# EAGLE design Mext (EAGLE 6.6.0)
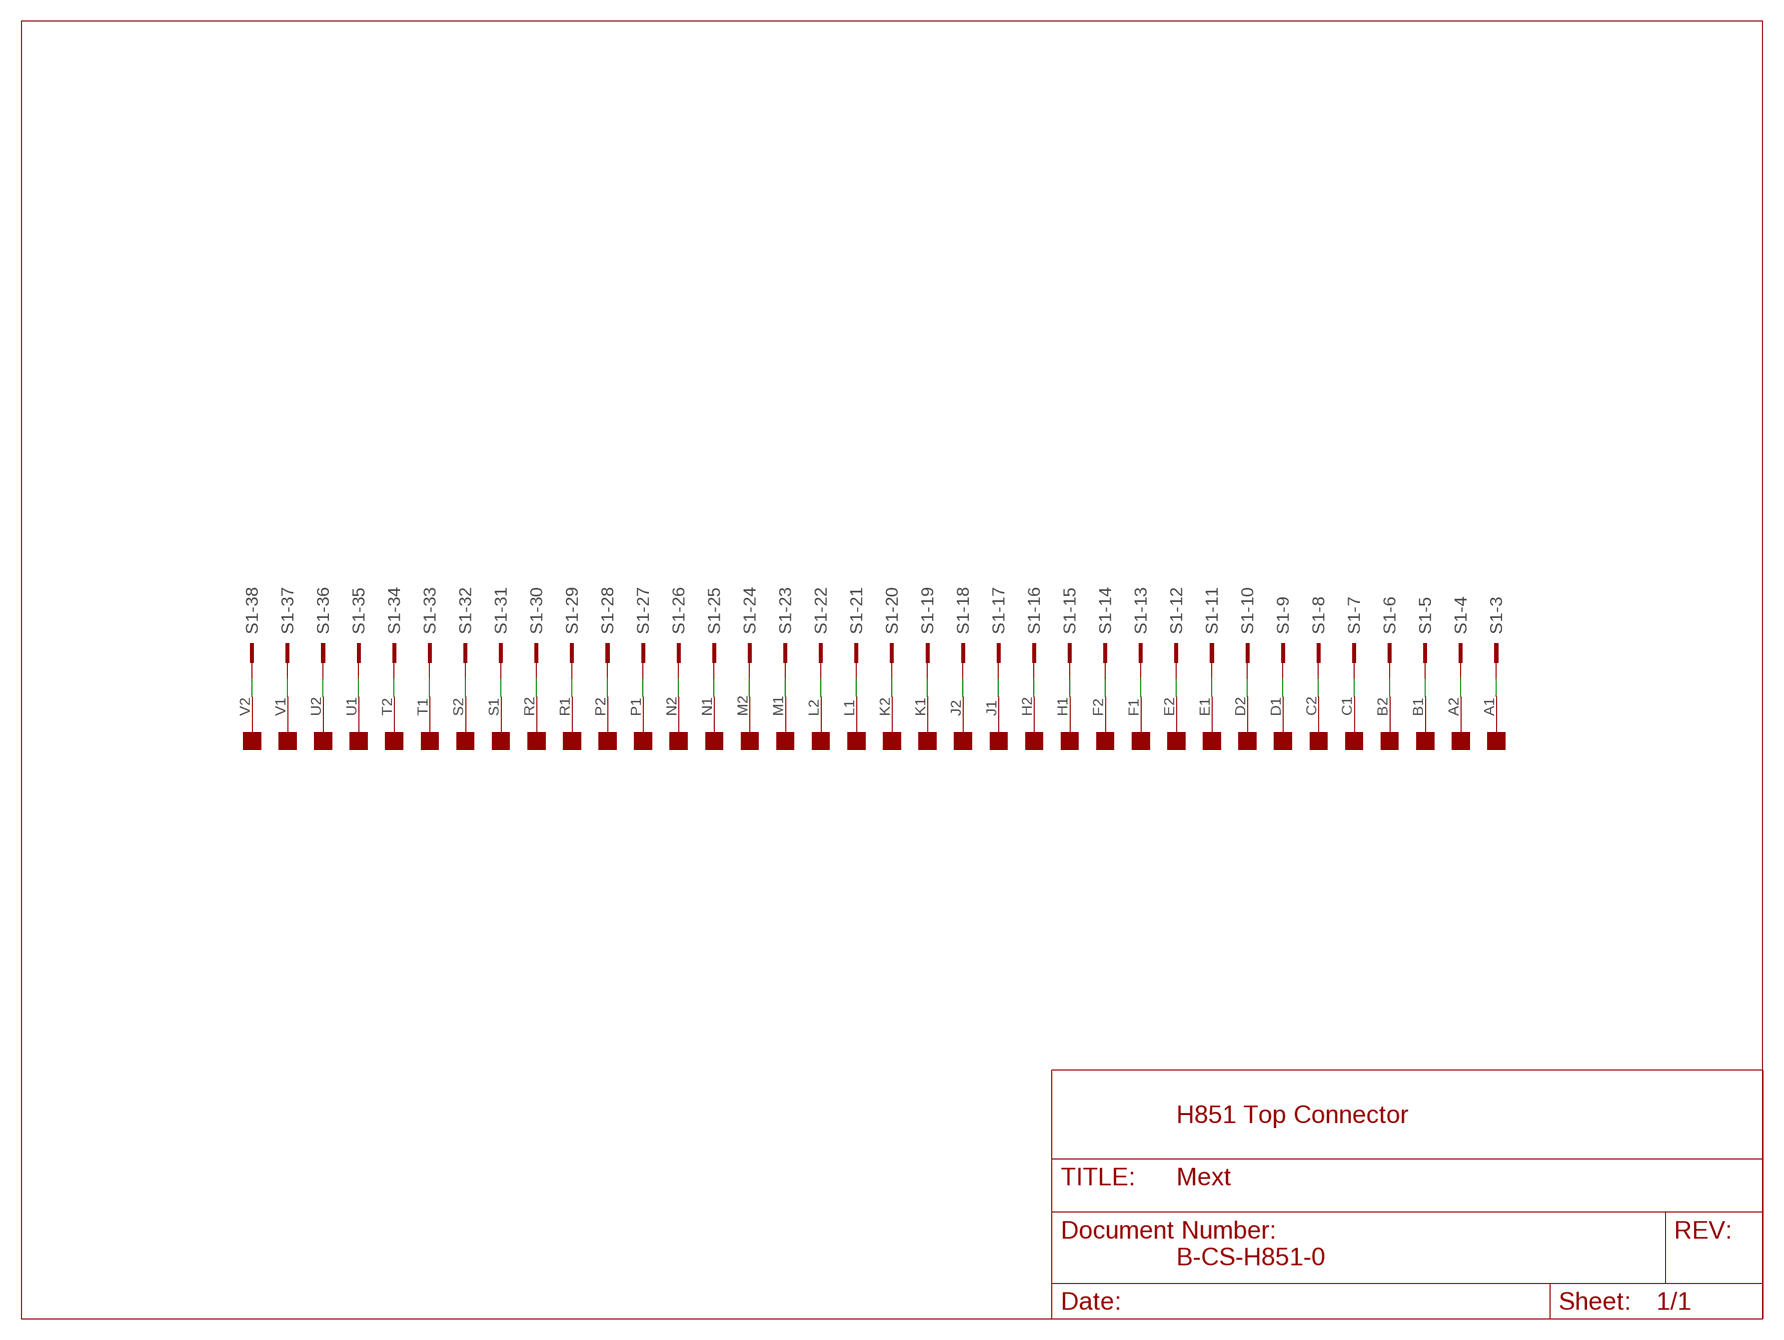
[diagram p0: schematic, sheet 1]

## Parts
S1  40  2540-  [PAK100/2500-40]
U$1  SINGLE  [EDGE-CON2]

## Nets
N$1: S1.37 U$1.V1
N$2: S1.38 U$1.V2
N$3: S1.35 U$1.U1
N$4: S1.36 U$1.U2
N$5: S1.33 U$1.T1
N$6: S1.34 U$1.T2
N$7: S1.31 U$1.S1
N$8: S1.32 U$1.S2
N$9: S1.29 U$1.R1
N$10: S1.30 U$1.R2
N$11: S1.27 U$1.P1
N$12: S1.28 U$1.P2
N$13: S1.25 U$1.N1
N$14: S1.26 U$1.N2
N$15: S1.23 U$1.M1
N$16: S1.24 U$1.M2
N$17: S1.21 U$1.L1
N$18: S1.22 U$1.L2
N$19: S1.19 U$1.K1
N$20: S1.20 U$1.K2
N$21: S1.17 U$1.J1
N$22: S1.18 U$1.J2
N$23: S1.15 U$1.H1
N$24: S1.16 U$1.H2
N$25: S1.13 U$1.F1
N$26: S1.14 U$1.F2
N$27: S1.11 U$1.E1
N$28: S1.12 U$1.E2
N$29: S1.9 U$1.D1
N$30: S1.10 U$1.D2
N$31: S1.7 U$1.C1
N$32: S1.8 U$1.C2
N$33: S1.5 U$1.B1
N$34: S1.6 U$1.B2
N$35: S1.4 U$1.A2
N$36: S1.3 U$1.A1
Unconnected: S1.1 S1.2 S1.39 S1.40

## Notes on the sheet
- H851 Top Connector
- B-CS-H851-0

## Library data of the parts
S1 = con-3m:2540-: 3M (TM) Pak 100 4-Wall Header Source: 3M; OC_FARNELL: unknown; OC_NEWARK: unknown
U$1 = dec-con:SINGLE: Single-Height DEC board

## Board
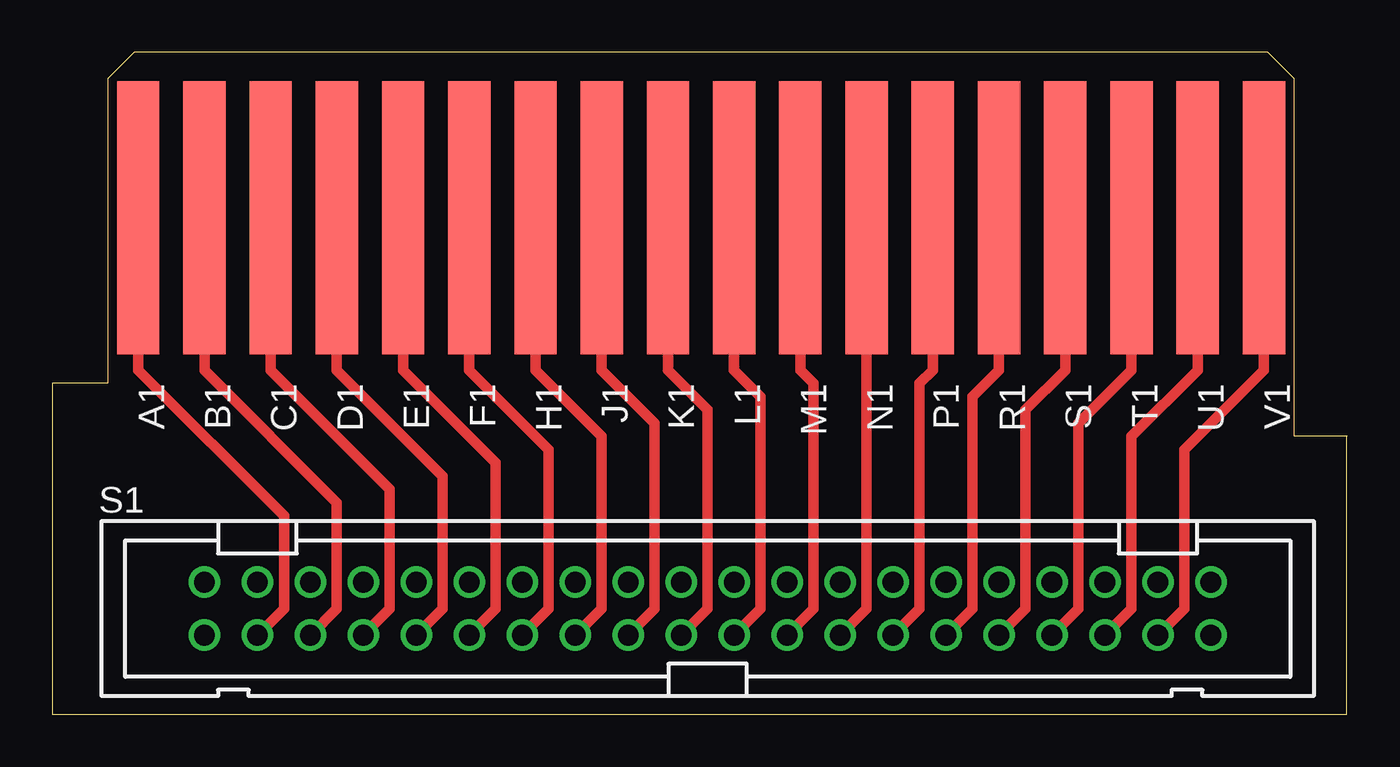
[diagram p1: board, top side]
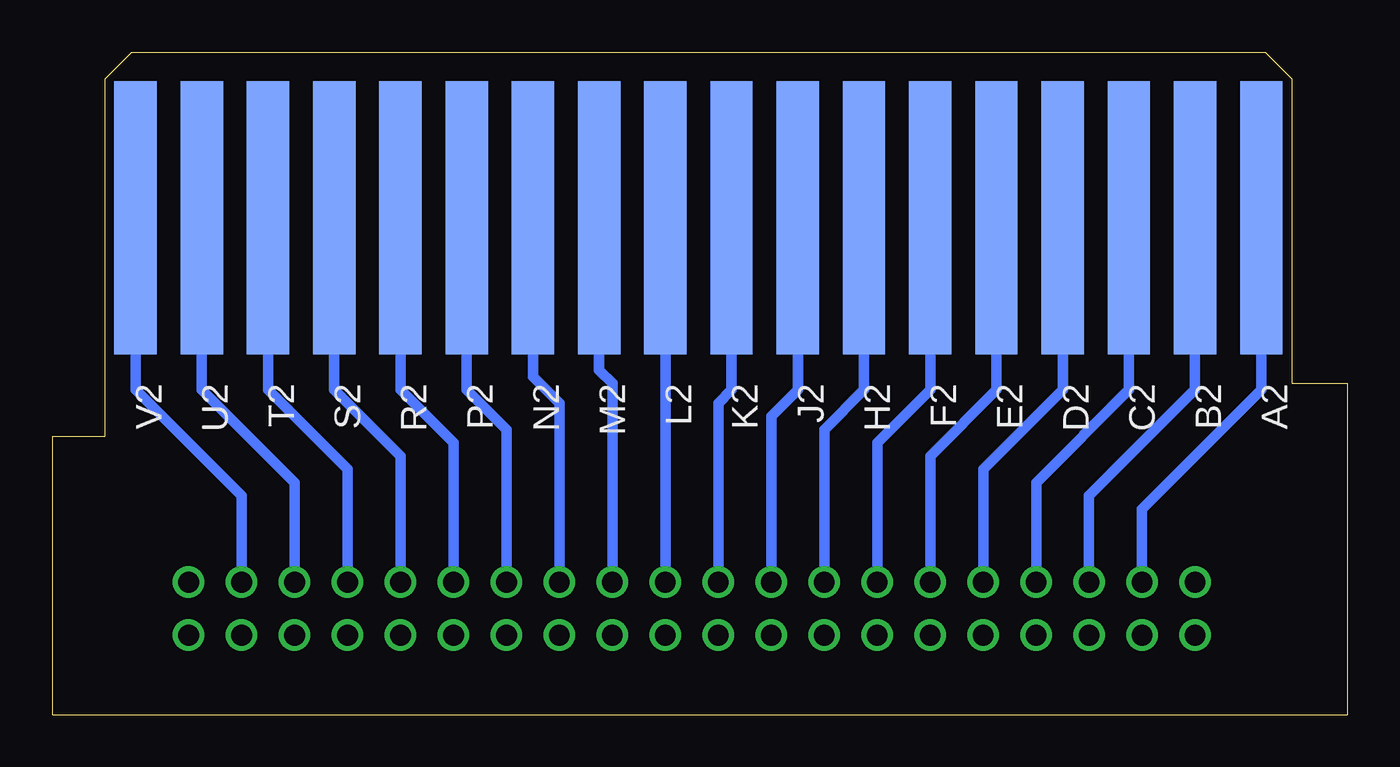
[diagram p2: board, bottom side, seen from below]

Size 62.1 x 31.75 mm. Coordinates in mm from the lower left corner, seen from the top.
Outline: 62.07,13.34 62.07,0 0,0 0,15.88
Copper layers (1+16): Top 0.035mm / dielectric 1.5mm / Bottom 0.035mm
Design rules "16mils *": minimum track width 16mil, minimum drill 32mil, track to track 15mil, track to pad 10mil, pad to pad 10mil, via to via 10mil, smd to smd 10mil, copper to edge 13mil, drill to drill 10mil, minimum pad ring 10mil, minimum via ring 8mil, stop-mask expansion 0mil, vias tented up to drill 0mil, thermal gap 10mil

### Footprints (pad centres in the part's own frame; a part is rotated, then mirrored left to right if it is on the bottom)
PAK100/2500-40 = drill 1 pad 1.422: 1 -24.13,-1.27; 2 -24.13,1.27; 3 -21.59,-1.27; 4 -21.59,1.27; 5 -19.05,-1.27; 6 -19.05,1.27; 7 -16.51,-1.27; 8 -16.51,1.27; 9 -13.97,-1.27; 10 -13.97,1.27; 11 -11.43,-1.27; 12 -11.43,1.27; 13 -8.89,-1.27; 14 -8.89,1.27; 15 -6.35,-1.27; 16 -6.35,1.27; 17 -3.81,-1.27; 18 -3.81,1.27; 19 -1.27,-1.27; 20 -1.27,1.27; 21 1.27,-1.27; 22 1.27,1.27; 23 3.81,-1.27; 24 3.81,1.27; 25 6.35,-1.27; 26 6.35,1.27; 27 8.89,-1.27; 28 8.89,1.27; 29 11.43,-1.27; 30 11.43,1.27; 31 13.97,-1.27; 32 13.97,1.27; 33 16.51,-1.27; 34 16.51,1.27; 35 19.05,-1.27; 36 19.05,1.27; 37 21.59,-1.27; 38 21.59,1.27; 39 24.13,-1.27; 40 24.13,1.27
EDGE-CON2 = smd 13.106 x 2.032: A1 7.938,4.128; B1 7.938,7.303; C1 7.938,10.477; D1 7.938,13.652; E1 7.938,16.828; F1 7.938,20.003; H1 7.938,23.177; J1 7.938,26.352; K1 7.938,29.527; L1 7.938,32.703; M1 7.938,35.877; N1 7.938,39.053; P1 7.938,42.227; R1 7.938,45.403; S1 7.938,48.578; T1 7.938,51.752; U1 7.938,54.928; V1 7.938,58.102 | smd 13.106 x 2.032 bottom: A2 7.938,4.128; B2 7.938,7.303; C2 7.938,10.477; D2 7.938,13.652; E2 7.938,16.828; F2 7.938,20.003; H2 7.938,23.177; J2 7.938,26.352; K2 7.938,29.527; L2 7.938,32.703; M2 7.938,35.877; N2 7.938,39.053; P2 7.938,42.227; R2 7.938,45.403; S2 7.938,48.578; T2 7.938,51.752; U2 7.938,54.928; V2 7.938,58.102

### Placement (x,y rotation side)
S1  31.43,5.08 0 top
U$1  0,31.75 270 top

### Tracks (layer width: path | path; a pad name or v marks a point on that pad's centre or on a via)
N$1
  Top 0.508: S1.37 54.29,5.08 54.29,12.7 58.1,16.51 U$1.V1
N$2
  Bottom 0.508: S1.38 53.02,10.48 58.1,15.56 U$1.V2
N$3
  Top 0.508: S1.35 51.75,5.08 51.75,13.34 54.93,16.51 U$1.U1
N$4
  Bottom 0.508: S1.36 50.48,11.11 54.93,15.56 U$1.U2
N$5
  Top 0.508: S1.33 49.21,5.08 49.21,13.97 51.75,16.51 U$1.T1
N$6
  Bottom 0.508: S1.34 47.94,11.75 51.75,15.56 U$1.T2
N$7
  Top 0.508: S1.31 46.67,5.08 46.67,14.61 48.58,16.51 U$1.S1
N$8
  Bottom 0.508: S1.32 45.4,12.38 48.58,15.56 U$1.S2
N$9
  Top 0.508: S1.29 44.13,5.08 44.13,15.24 45.4,16.51 U$1.R1
N$10
  Bottom 0.508: S1.30 42.86,13.02 45.4,15.56 U$1.R2
N$11
  Top 0.508: S1.27 41.59,5.08 41.59,15.88 42.23,16.51 U$1.P1
N$12
  Bottom 0.508: S1.28 40.32,13.65 42.23,15.56 U$1.P2
N$13
  Top 0.508: S1.25 39.05,5.08 U$1.N1
N$14
  Bottom 0.508: S1.26 37.78,14.92 39.05,16.19 U$1.N2
N$15
  Top 0.508: S1.23 36.51,5.08 36.51,15.88 35.88,16.51 U$1.M1
N$16
  Bottom 0.508: S1.24 35.24,15.88 35.88,16.51 U$1.M2
N$17
  Top 0.508: S1.21 33.97,5.08 33.97,15.24 32.7,16.51 U$1.L1
N$18
  Bottom 0.508: S1.22 U$1.L2
N$19
  Top 0.508: S1.19 31.43,5.08 31.43,14.61 29.53,16.51 U$1.K1
N$20
  Bottom 0.508: S1.20 30.16,14.92 29.53,15.56 U$1.K2
N$21
  Top 0.508: S1.17 28.89,5.08 28.89,13.97 26.35,16.51 U$1.J1
N$22
  Bottom 0.508: S1.18 27.62,14.29 26.35,15.56 U$1.J2
N$23
  Top 0.508: S1.15 26.35,5.08 26.35,13.34 23.18,16.51 U$1.H1
N$24
  Bottom 0.508: S1.16 25.08,13.65 23.18,15.56 U$1.H2
N$25
  Top 0.508: S1.13 23.81,5.08 23.81,12.7 20,16.51 U$1.F1
N$26
  Bottom 0.508: S1.14 22.54,13.02 20,15.56 U$1.F2
N$27
  Top 0.508: S1.11 21.27,5.08 21.27,12.06 16.83,16.51 U$1.E1
N$28
  Bottom 0.508: S1.12 20,12.38 16.83,15.56 16.83,17.46 16.8,20.98 U$1.E2 16.83,23.87
N$29
  Top 0.508: S1.9 18.73,5.08 18.73,11.43 13.65,16.51 U$1.D1
N$30
  Bottom 0.508: S1.10 17.46,11.75 13.65,15.56 U$1.D2
N$31
  Top 0.508: S1.7 16.19,5.08 16.19,10.79 10.48,16.51 U$1.C1
N$32
  Bottom 0.508: S1.8 14.92,11.11 10.48,15.56 U$1.C2
N$33
  Top 0.508: S1.5 13.65,5.08 13.65,10.16 7.3,16.51 U$1.B1
N$34
  Bottom 0.508: S1.6 12.38,10.48 7.3,15.56 U$1.B2
N$35
  Bottom 0.508: S1.4 9.84,9.84 4.13,15.56 U$1.A2
N$36
  Top 0.508: S1.3 11.11,5.08 11.11,9.53 4.13,16.51 U$1.A1